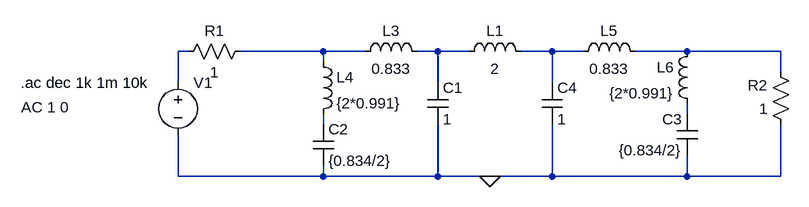
[diagram p0: schematic ej4.asc]
ej4.asc, the LTspice schematic file:
Version 4
SHEET 1 880 680
WIRE -176 64 -192 64
WIRE 32 64 -96 64
WIRE 96 64 32 64
WIRE 208 64 176 64
WIRE 256 64 208 64
WIRE 384 64 336 64
WIRE 432 64 384 64
WIRE 592 64 512 64
WIRE 736 64 592 64
WIRE 32 80 32 64
WIRE 736 96 736 64
WIRE -192 112 -192 64
WIRE 208 112 208 64
WIRE 384 112 384 64
WIRE 592 160 592 144
WIRE 32 176 32 160
WIRE -192 256 -192 192
WIRE 32 256 32 240
WIRE 32 256 -192 256
WIRE 208 256 208 176
WIRE 208 256 32 256
WIRE 288 256 208 256
WIRE 384 256 384 176
WIRE 384 256 288 256
WIRE 592 256 592 224
WIRE 592 256 384 256
WIRE 736 256 736 176
WIRE 736 256 592 256
FLAG 288 256 0
SYMBOL voltage -192 96 R0
WINDOW 123 -241 54 Left 2
WINDOW 39 0 0 Left 0
SYMATTR InstName V1
SYMATTR Value ""
SYMATTR Value2 AC 1 0
SYMBOL res -80 48 R90
WINDOW 0 0 56 VBottom 2
WINDOW 3 32 56 VTop 2
SYMATTR InstName R1
SYMATTR Value 1
SYMBOL res 752 192 R180
WINDOW 0 36 76 Left 2
WINDOW 3 36 40 Left 2
SYMATTR InstName R2
SYMATTR Value 1
SYMBOL ind 80 80 R270
WINDOW 0 32 56 VTop 2
WINDOW 3 5 56 VBottom 2
SYMATTR InstName L3
SYMATTR Value 0.833
SYMBOL ind 16 64 R0
SYMATTR InstName L4
SYMATTR Value {2*0.991}
SYMBOL cap 16 176 R0
SYMATTR InstName C2
SYMATTR Value {0.834/2}
SYMBOL ind 528 80 M270
WINDOW 0 32 56 VTop 2
WINDOW 3 5 56 VBottom 2
SYMATTR InstName L5
SYMATTR Value 0.833
SYMBOL ind 608 48 M0
SYMATTR InstName L6
SYMATTR Value {2*0.991}
SYMBOL cap 608 160 M0
SYMATTR InstName C3
SYMATTR Value {0.834/2}
SYMBOL cap 192 112 R0
SYMATTR InstName C1
SYMATTR Value 1
SYMBOL cap 368 112 R0
SYMATTR InstName C4
SYMATTR Value 1
SYMBOL ind 240 80 R270
WINDOW 0 32 56 VTop 2
WINDOW 3 5 56 VBottom 2
SYMATTR InstName L1
SYMATTR Value 2
TEXT -434 112 Left 2 !.ac dec 1k 1m 10k

The netlist it stands for:
* ej4.asc
V1 N001 0 AC 1 0
R1 N002 N001 1
R2 0 N005 1
L3 N002 N003 0.833
L4 N002 N007 {2*0.991}
C2 N007 0 {0.834/2}
L5 N005 N004 0.833
L6 N005 N006 {2*0.991}
C3 N006 0 {0.834/2}
C1 N003 0 1
C4 N004 0 1
L1 N003 N004 2
.ac dec 1k 1m 10k
.backanno
.end